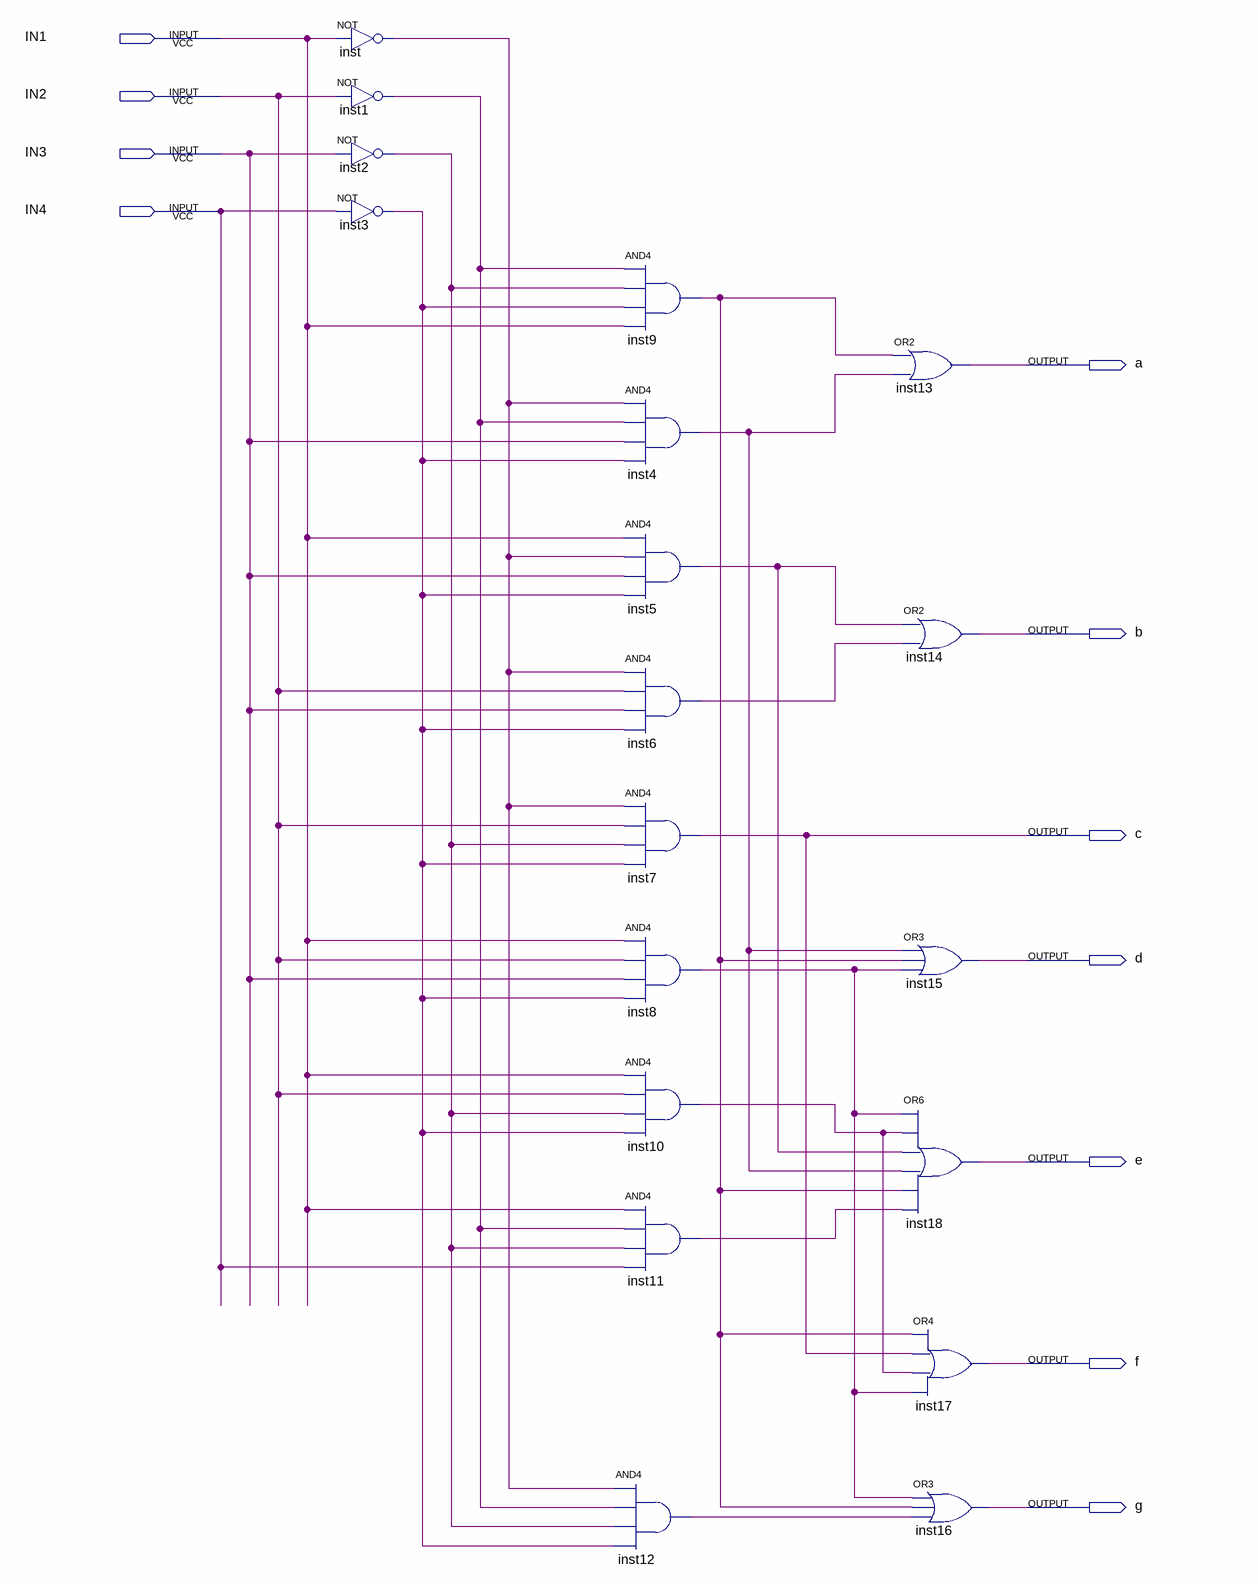
[diagram p0: schematic sheet]
// Quartus schematic top.bdf as structural Verilog: 19 symbols, 11 pins
module top (
  input  IN1,
  input  IN2,
  input  IN3,
  input  IN4,
  output a,
  output b,
  output c,
  output d,
  output e,
  output f,
  output g
);

  wire inst1_out, inst2_out, inst3_out, inst4_out, inst5_out, inst6_out, inst8_out, inst9_out, inst10_out,
       inst11_out, inst12_out, inst_out;

  not inst (inst_out, IN1);
  not inst1 (inst1_out, IN2);
  not inst2 (inst2_out, IN3);
  not inst3 (inst3_out, IN4);
  and inst9 (inst9_out, inst1_out, inst2_out, inst3_out, IN1);
  and inst4 (inst4_out, inst_out, inst1_out, IN3, inst3_out);
  and inst5 (inst5_out, IN1, inst_out, IN3, inst3_out);
  and inst6 (inst6_out, inst_out, IN2, IN3, inst3_out);
  and inst7 (c, inst_out, IN2, inst2_out, inst3_out);
  and inst8 (inst8_out, IN1, IN2, IN3, inst3_out);
  and inst10 (inst10_out, IN1, IN2, inst2_out, inst3_out);
  and inst11 (inst11_out, IN1, inst1_out, inst2_out, IN4);
  and inst12 (inst12_out, inst_out, inst1_out, inst2_out, inst3_out);
  or inst13 (a, inst9_out, inst4_out);
  or inst14 (b, inst5_out, inst6_out);
  or inst15 (d, inst4_out, inst9_out, inst8_out);
  or inst18 (e, inst8_out, inst10_out, inst5_out, inst4_out, inst9_out, inst11_out);
  or inst17 (f, inst9_out, c, inst10_out, inst8_out);
  or inst16 (g, inst8_out, inst9_out, inst12_out);
endmodule
